# EAGLE schematic OECOC_controlbordroutes (EAGLE 9.6.2)
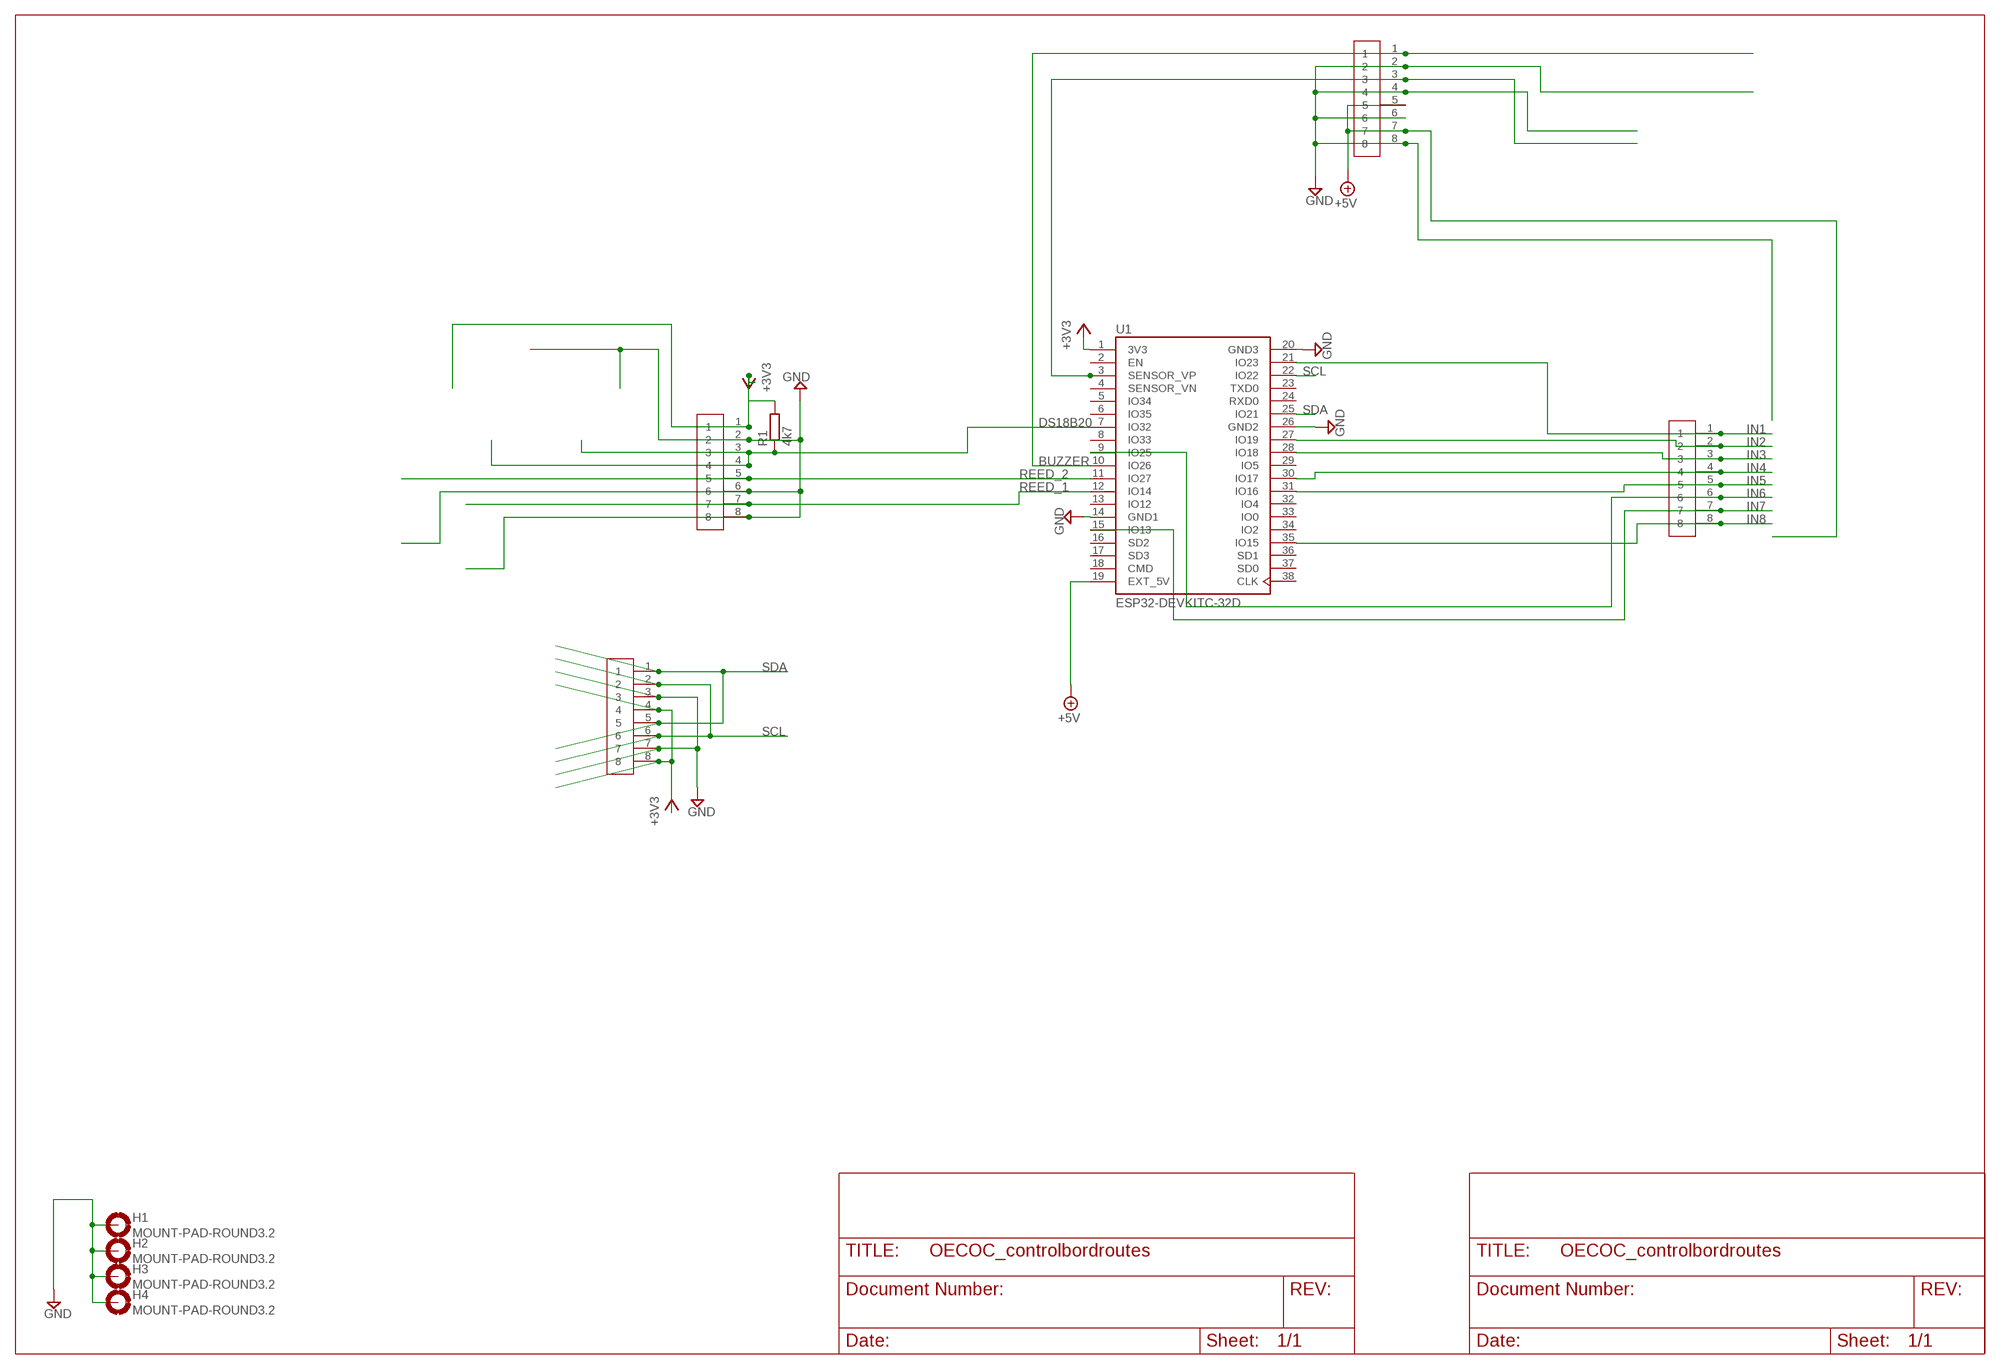
[diagram p0: schematic, sheet 1]

## Parts
H1  MOUNT-PAD-ROUND3.2  [3,2-PAD]
H2  MOUNT-PAD-ROUND3.2  [3,2-PAD]
H3  MOUNT-PAD-ROUND3.2  [3,2-PAD]
H4  MOUNT-PAD-ROUND3.2  [3,2-PAD]
R1  4k7  R-EU_0207/10  [0207/10]
U1  ESP32-DEVKITC-32D  [MODULE_ESP32-DEVKITC-32D]
U$3  PHOENIXCONTACT_PINSTRIP  [HDRV8W150P500_1X8_2488X140X1204B]
U$6  PHOENIXCONTACT_PINSTRIP  [HDRV8W150P500_1X8_2488X140X1204B]
U$7  PHOENIXCONTACT_PINSTRIP  [HDRV8W150P500_1X8_2488X140X1204B]
U$8  PHOENIXCONTACT_PINSTRIP  [HDRV8W150P500_1X8_2488X140X1204B]

## Nets
+3V3: R1.2 U1.1(3V3) U$3.4 U$3.8 U$6.1
+5V: U1.19(EXT_5V) U$8.5 U$8.7
BUZZER: U1.10(IO26) U$8.1
DS18B20: R1.1 U1.7(IO32) U$6.3 U$6.4
GND: H1.B3,2(MOUNT) H2.B3,2(MOUNT) H3.B3,2(MOUNT) H4.B3,2(MOUNT) U1.14(GND1) U1.20(GND3) U1.26(GND2) U$3.3 U$3.7 U$6.2 U$6.6 U$6.8 U$8.2 U$8.4 U$8.6 U$8.8
IN1: U1.21(IO23) U$7.1
IN2: U1.27(IO19) U$7.2
IN3: U1.28(IO18) U$7.3
IN4: U1.30(IO17) U$7.4
IN5: U1.31(IO16) U$7.5
IN6: U1.9(IO25) U$7.6
IN7: U1.15(IO13) U$7.7
IN8: U1.35(IO15) U$7.8
N$1: U1.3(SENSOR_VP) U$8.3
REED_1: U1.12(IO14) U$6.7
REED_2: U1.11(IO27) U$6.5
SCL: U1.22(IO22) U$3.2 U$3.6
SDA: U1.25(IO21) U$3.1 U$3.5
Unconnected: U1.2(EN) U1.4(SENSOR_VN) U1.5(IO34) U1.6(IO35) U1.8(IO33) U1.13(IO12) U1.16(SD2) U1.17(SD3) U1.18(CMD) U1.23(TXD0) U1.24(RXD0) U1.29(IO5) U1.32(IO4) U1.33(IO0) U1.34(IO2) U1.36(SD1) U1.37(SD0) U1.38(CLK)

## Library data of the parts
H1-H4 = holes:MOUNT-PAD-ROUND: MOUNTING PAD, round
R1 = rcl:R-EU_: RESISTOR, European symbol; SPICEPREFIX: R
U1 = Personal:ESP32-DEVKITC-32D: Eval Board For Esp-Wroom-32 Check prices <https://pricing.snapeda.com/parts/ESP32-DEVKITC-32D/Espressif%20Systems/view-part?ref=eda>; AVAILABILITY: In Stock; DESCRIPTION: WiFi Development Tools (802.11) ESP32 General Development Kit, ESP32-WROOM-32D on the board; MF: Espressif Systems; MP: ESP32-DEVKITC-32D; PACKAGE: None; PRICE: None; PURCHASE-URL: https://pricing.snapeda.com/search/part/ESP32-DEVKITC-32D/?ref=eda
U$3 U$6-U$8 = Personal:PHOENIXCONTACT_PINSTRIP